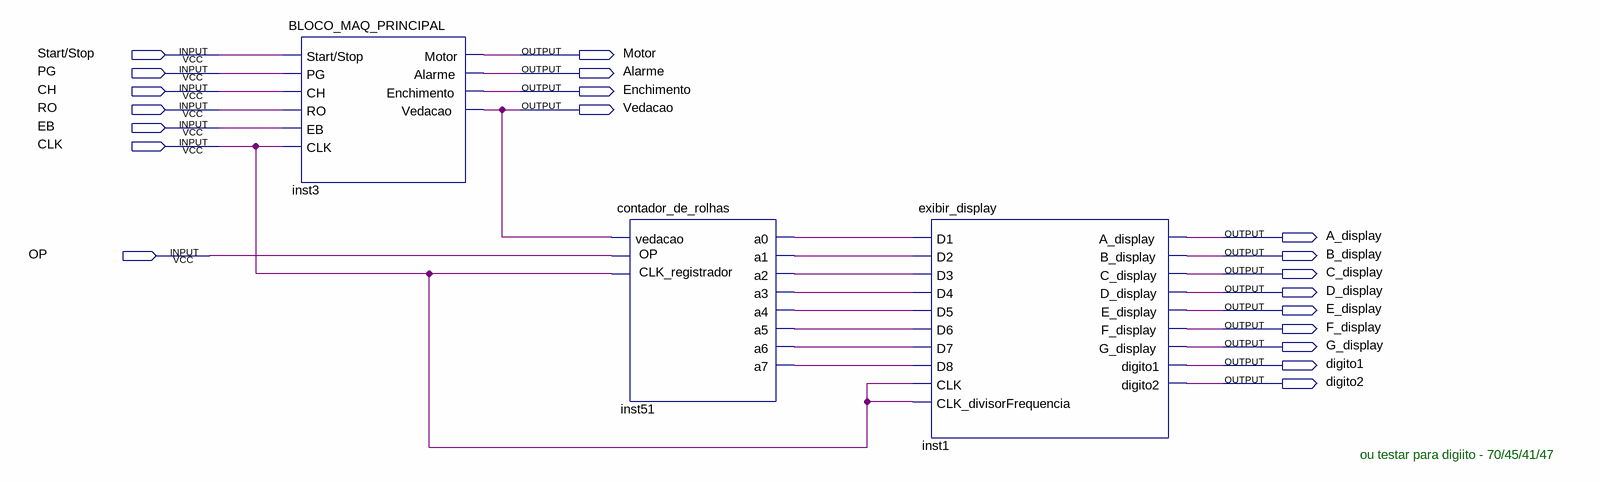
[diagram p0: schematic sheet]
// Quartus schematic problema3_industria.bdf as structural Verilog: 3 symbols, 20 pins
module problema3_industria (
  input  \Start/Stop ,
  input  PG,
  input  CH,
  input  RO,
  input  EB,
  input  CLK,
  input  OP,
  output Motor,
  output Alarme,
  output Enchimento,
  output Vedacao,
  output A_display,
  output B_display,
  output C_display,
  output D_display,
  output E_display,
  output F_display,
  output G_display,
  output digito1,
  output digito2
);

  wire inst51_a0, inst51_a1, inst51_a2, inst51_a3, inst51_a4, inst51_a5, inst51_a6, inst51_a7;

  BLOCO_MAQ_PRINCIPAL inst3 (
    .\Start/Stop (\Start/Stop ), .PG(PG), .CH(CH), .RO(RO), .EB(EB), .CLK(CLK), .Motor(Motor),
    .Alarme(Alarme), .Enchimento(Enchimento), .Vedacao(Vedacao));
  contador_de_rolhas inst51 (
    .vedacao(Vedacao), .CLK_registrador(OP), .OP(CLK), .a0(inst51_a0), .a1(inst51_a1), .a2(inst51_a2),
    .a3(inst51_a3), .a4(inst51_a4), .a5(inst51_a5), .a6(inst51_a6), .a7(inst51_a7));
  exibir_display inst1 (
    .D1(inst51_a0), .D2(inst51_a1), .D3(inst51_a2), .D4(inst51_a3), .D5(inst51_a4), .D6(inst51_a5),
    .D7(inst51_a6), .D8(inst51_a7), .CLK(CLK), .CLK_divisorFrequencia(CLK), .A_display(A_display),
    .B_display(B_display), .C_display(C_display), .D_display(D_display), .E_display(E_display),
    .F_display(F_display), .G_display(G_display), .digito1(digito1), .digito2(digito2));

  // Notes on the sheet:
  //   ou testar para digiito - 70/45/41/47
endmodule
